# Altium project PCB_SBW_Assist.PrjPcb
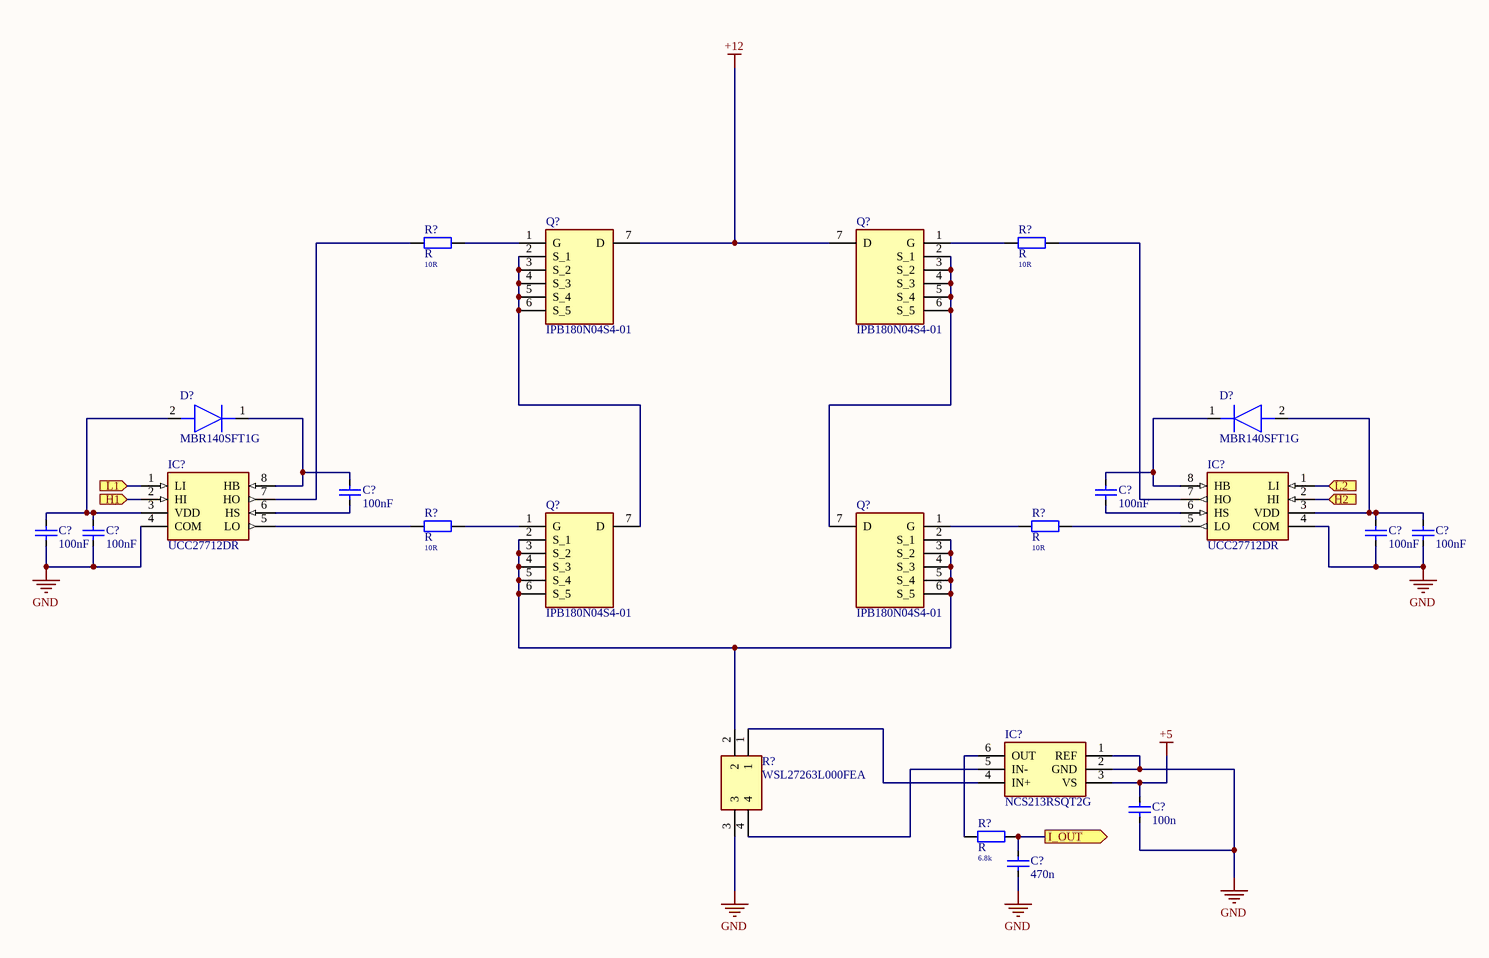
[diagram p0: PCB_SBW_Assist.SchDoc]
3 sheets, 129 parts. Net scope: flat (ports and power ports of the same name join across sheets).
Board file: PCB_SBW_Assist.PcbDoc
Sheets:
  PCB_SBW_Assist.SchDoc
  Microcontroller.SchDoc
  analog_signal.SchDoc

## Sheet PCB_SBW_Assist.SchDoc
size A2

### Parts
(Parts that share a designator on the sheet are numbered #1, #2 ... from top to bottom, then left to right.)
C?#1  value 100nF  [CAPC3216X18N]  (hidden comment: C)
C?#2  value 100nF  [CAPC3216X18N]  (hidden comment: C)
C?#3  value 100nF  [CAPC3216X18N]  (hidden comment: C)
C?#4  value 100nF  [CAPC3216X18N]  (hidden comment: C)
C?#5  value 100nF  [CAPC3216X18N]  (hidden comment: C)
C?#6  value 100nF  [CAPC3216X18N]  (hidden comment: C)
C?#7  value 100n  [CAPC3216X18N]  (hidden comment: C)
C?#8  value 470n  [CAPC3216X18N]  (hidden comment: C)
D?#1  MBR140SFT1G  [SODFL3616X98N]
D?#2  MBR140SFT1G  [SODFL3616X98N]
IC?#1  UCC27712DR  [SOIC127P600X175-8N]
IC?#2  UCC27712DR  [SOIC127P600X175-8N]
IC?#3  NCS213RSQT2G  [SOT65P210X110-6N]
Q?#1  IPB180N04S4-01  [IPB240N04S4R9ATMA1]
Q?#2  IPB180N04S4-01  [IPB240N04S4R9ATMA1]
Q?#3  IPB180N04S4-01  [IPB240N04S4R9ATMA1]
Q?#4  IPB180N04S4-01  [IPB240N04S4R9ATMA1]
R?#1  R  value 10R  [RESC3216X07N]
R?#2  R  value 10R  [RESC3216X07N]
R?#3  R  value 10R  [RESC3216X07N]
R?#4  R  value 10R  [RESC3216X07N]
R?#5  WSL27263L000FEA  [WSL27263L000FEA]
R?#6  R  value 6.8k  [RESC1608X06N]

### Ports
H1 (in), H2 (in), I_OUT (out), L1 (in), L2 (in)

### Nets
+5: C?#7.2 IC?#3.3(VS)
+12: Q?#1.7(D) Q?#2.7(D)
GND: C?#3.1 C?#4.1 C?#5.1 C?#6.1 C?#7.1 C?#8.1 IC?#1.4(COM) IC?#2.4(COM) IC?#3.1(REF) IC?#3.2(GND) R?#5.3
NetC?#1_1: C?#1.1 IC?#1.6(HS)
NetC?#1_2: C?#1.2 D?#1.1(K) IC?#1.8(HB)
NetC?#2_1: C?#2.1 IC?#2.6(HS)
NetC?#2_2: C?#2.2 D?#2.1(K) IC?#2.8(HB)
NetC?#3_2: C?#3.2 C?#4.2 D?#1.2(A) IC?#1.3(VDD)
NetC?#5_2: C?#5.2 C?#6.2 D?#2.2(A) IC?#2.3(VDD)
NetC?#8_2: C?#8.2 R?#6.2 ; port I_OUT
NetIC?#1_1: IC?#1.1(LI) ; port L1
NetIC?#1_2: IC?#1.2(HI) ; port H1
NetIC?#1_5: IC?#1.5(LO) R?#3.1
NetIC?#1_7: IC?#1.7(HO) R?#1.1
NetIC?#2_1: IC?#2.1(LI) ; port L2
NetIC?#2_2: IC?#2.2(HI) ; port H2
NetIC?#2_5: IC?#2.5(LO) R?#4.2
NetIC?#2_7: IC?#2.7(HO) R?#2.2
NetIC?#3_4: IC?#3.4(IN+) R?#5.1
NetIC?#3_5: IC?#3.5(IN-) R?#5.4
NetIC?#3_6: IC?#3.6(OUT) R?#6.1
NetQ?#1_1: Q?#1.1(G) R?#1.2
NetQ?#1_2: Q?#1.2(S_1) Q?#1.3(S_2) Q?#1.4(S_3) Q?#1.5(S_4) Q?#1.6(S_5) Q?#3.7(D)
NetQ?#2_1: Q?#2.1(G) R?#2.1
NetQ?#2_2: Q?#2.2(S_1) Q?#2.3(S_2) Q?#2.4(S_3) Q?#2.5(S_4) Q?#2.6(S_5) Q?#4.7(D)
NetQ?#3_1: Q?#3.1(G) R?#3.2
NetQ?#3_2: Q?#3.2(S_1) Q?#3.3(S_2) Q?#3.4(S_3) Q?#3.5(S_4) Q?#3.6(S_5) Q?#4.2(S_1) Q?#4.3(S_2) Q?#4.4(S_3) Q?#4.5(S_4) Q?#4.6(S_5) R?#5.2
NetQ?#4_1: Q?#4.1(G) R?#4.1

### Notes on the sheet
- Title
- Size:
- Date:
- File:
- A2
- Number:
- Time:
- Revision:
- Sheet
- of

### Library data of the parts
C?#1-C?#6 = C: Parameter 2: 06033C104KAT4A; Link: https://www.lcsc.com/product-detail/Multilayer-Ceramic-Capacitors-MLCC-SMD-SMT_Kyocera-AVX-06033C104KAT4A_C2167104.html
C?#7 = C: MPN: 06033C104KAT4A; Link: https://www.lcsc.com/product-detail/Multilayer-Ceramic-Capacitors-MLCC-SMD-SMT_Kyocera-AVX-06033C104KAT4A_C2167104.html
C?#8 = C: MPN: Samwha Capacitor CS1608X7R474K250NRB; Link: https://www.lcsc.com/product-detail/Multilayer-Ceramic-Capacitors-MLCC-SMD-SMT_Samwha-Capacitor-CS1608X7R474K250NRB_C2909628.html
D?#1 D?#2 = MBR140SFT1G: Diode; Manufacturer_Name: onsemi; Datasheet Link: http://www.onsemi.com/pub/Collateral/MBR140SFT1-D.PDF; Height: 0.98mm; Manufacturer_Part_Number: MBR140SFT1G; Mouser Part Number: 863-MBR140SFT1G; Mouser Price/Stock: https://www.mouser.co.uk/ProductDetail/onsemi/MBR140SFT1G?qs=3JMERSakebrc0eIUjXPasA%3D%3D; Arrow Part Number: MBR140SFT1G; Arrow Price/Stock: https://www.arrow.com/en/products/mbr140sft1g/on-semiconductor?region=nac
IC?#1 IC?#2 = UCC27712DR: Integrated Circuit; Manufacturer_Name: Texas Instruments; Datasheet Link: http://www.ti.com/lit/gpn/ucc27712; Height: 1.75mm; Manufacturer_Part_Number: UCC27712DR; Mouser Part Number: 595-UCC27712DR; Mouser Price/Stock: https://www.mouser.co.uk/ProductDetail/Texas-Instruments/UCC27712DR?qs=HXFqYaX1Q2zHY4iSzkrxAA%3D%3D; Arrow Part Number: UCC27712DR; Arrow Price/Stock: https://www.arrow.com/en/products/ucc27712dr/texas-instruments?region=nac
IC?#3 = NCS213RSQT2G: Integrated Circuit; Manufacturer_Name: onsemi; Datasheet Link: http://www.onsemi.com/pub/Collateral/NCS210R-D.PDF; Height: 1.1mm; Manufacturer_Part_Number: NCS213RSQT2G; Mouser Part Number: 863-NCS213RSQT2G; Mouser Price/Stock: https://www.mouser.co.uk/ProductDetail/onsemi/NCS213RSQT2G?qs=y6ZabgHbY%252ByBI46PuwlxCQ%3D%3D; Arrow Part Number: NCS213RSQT2G; Arrow Price/Stock: https://www.arrow.com/en/products/ncs213rsqt2g/on-semiconductor?region=nac
Q?#1-Q?#4 = IRFS3107-7PPBF: MOSFET (N-Channel); Manufacturer_Name: Infineon; Datasheet Link: https://www.lcsc.com/datasheet/lcsc_datasheet_2409301305_Infineon-Technologies-IPB180N04S4-01_C536569.pdf; Height: 4mm; Manufacturer_Part_Number: IPB180N04S4-01; Mouser Part Number: 942-IRFS3107-7PPBF; Mouser Price/Stock: https://www.lcsc.com/product-detail/MOSFETs_Infineon-Technologies-IPB180N04S4-01_C536569.html; Arrow Part Number: IPB180N04S4-01; Arrow Price/Stock: https://www.arrow.com/en/products/irfs3107-7ppbf/infineon-technologies-ag
R?#1-R?#4 = R: MPN: 1206W4F100JT5E; Link: https://www.lcsc.com/product-detail/Chip-Resistor-Surface-Mount_UNI-ROYAL-Uniroyal-Elec-1206W4F100JT5E_C17903.html
R?#5 = WSL27263L000FEA: Resistor; Manufacturer_Name: Vishay; Datasheet Link: https://www.vishay.com/docs/30131/wsl2726.pdf; Height: 2.99mm; Manufacturer_Part_Number: WSL27263L000FEA; Mouser Part Number: 71-WSL27263L000FEA; Mouser Price/Stock: https://www.mouser.co.uk/ProductDetail/Vishay-Dale/WSL27263L000FEA?qs=eFWhpKjIuGhZ1Mn4MB4N%252Bg%3D%3D; Arrow Part Number: WSL27263L000FEA; Arrow Price/Stock: https://www.arrow.com/en/products/wsl27263l000fea/vishay
R?#6 = R: MPN: YAGEO RC0603FR-076K8L; Link: https://www.lcsc.com/product-detail/Chip-Resistor-Surface-Mount_YAGEO-RC0603FR-076K8L_C114632.html

## Sheet Microcontroller.SchDoc
size A2; Organization: Altium Limited; Address1: L3, 12a Rodborough Rd; Address2: Frenchs Forest; Address3: NSW; Address4: Australia 2086
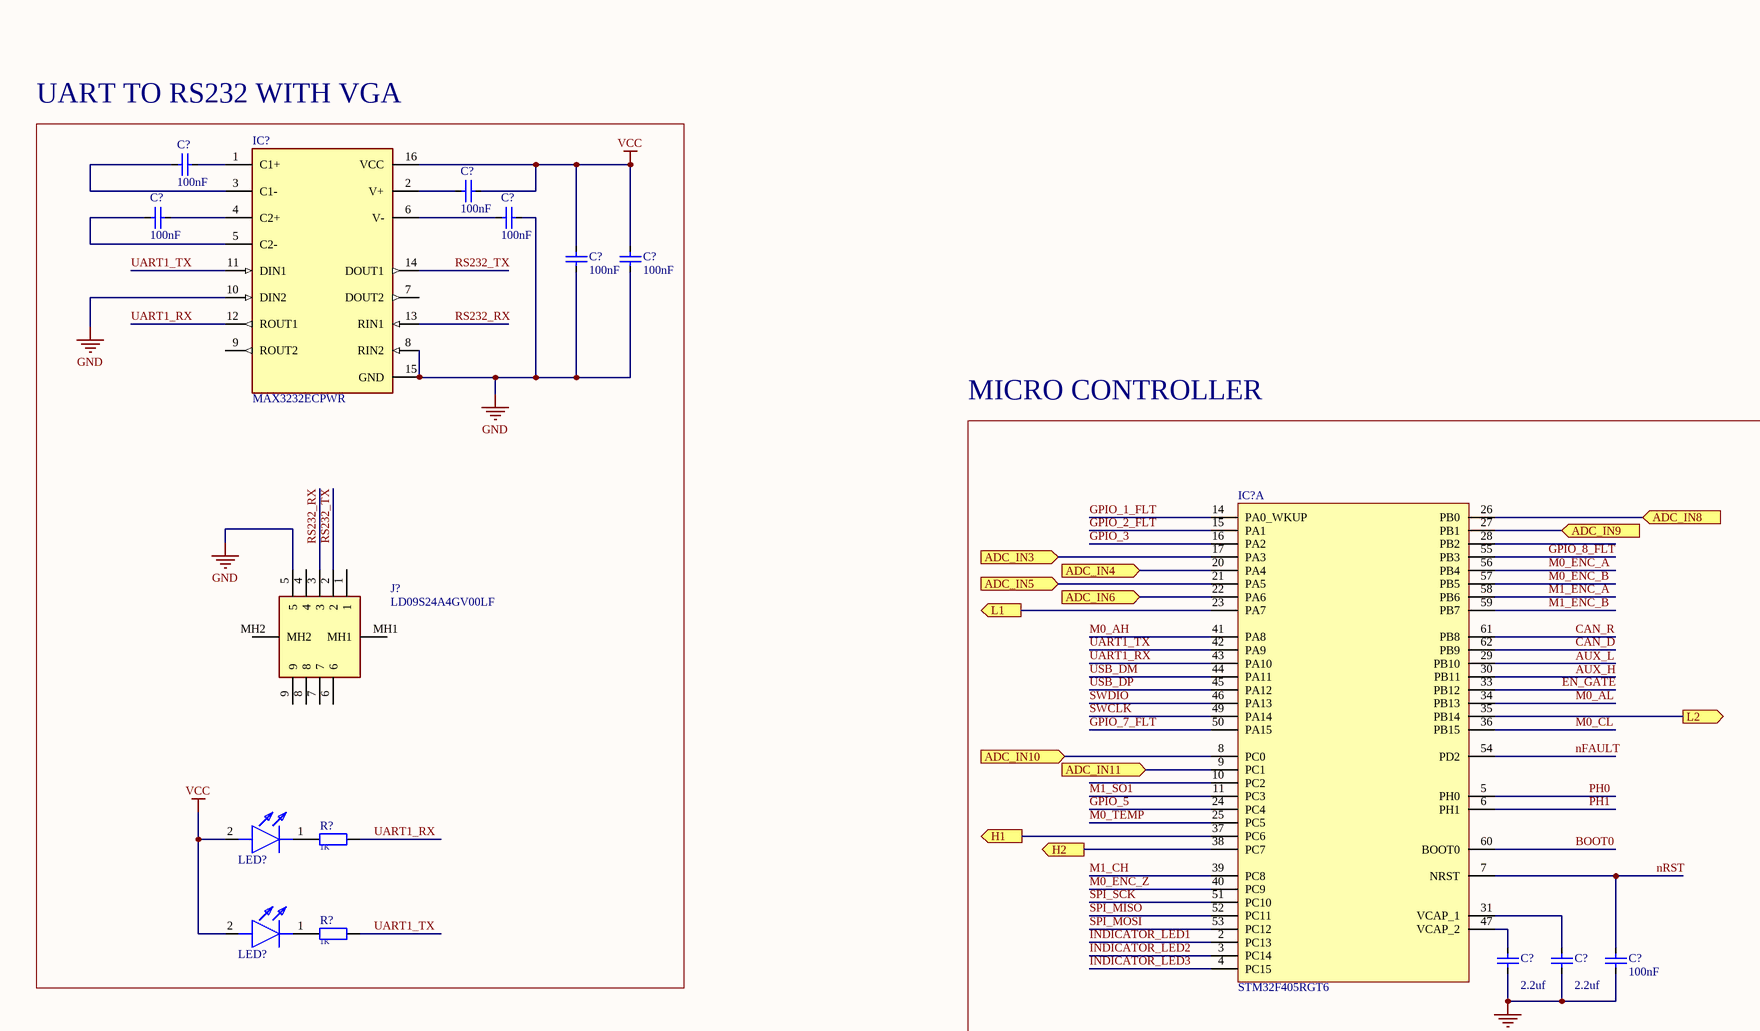
[diagram p1: Microcontroller.SchDoc, top left]
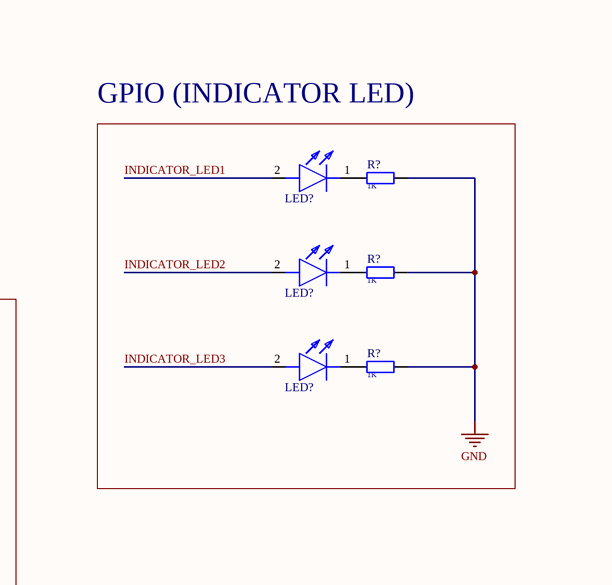
[diagram p2: Microcontroller.SchDoc, top right]
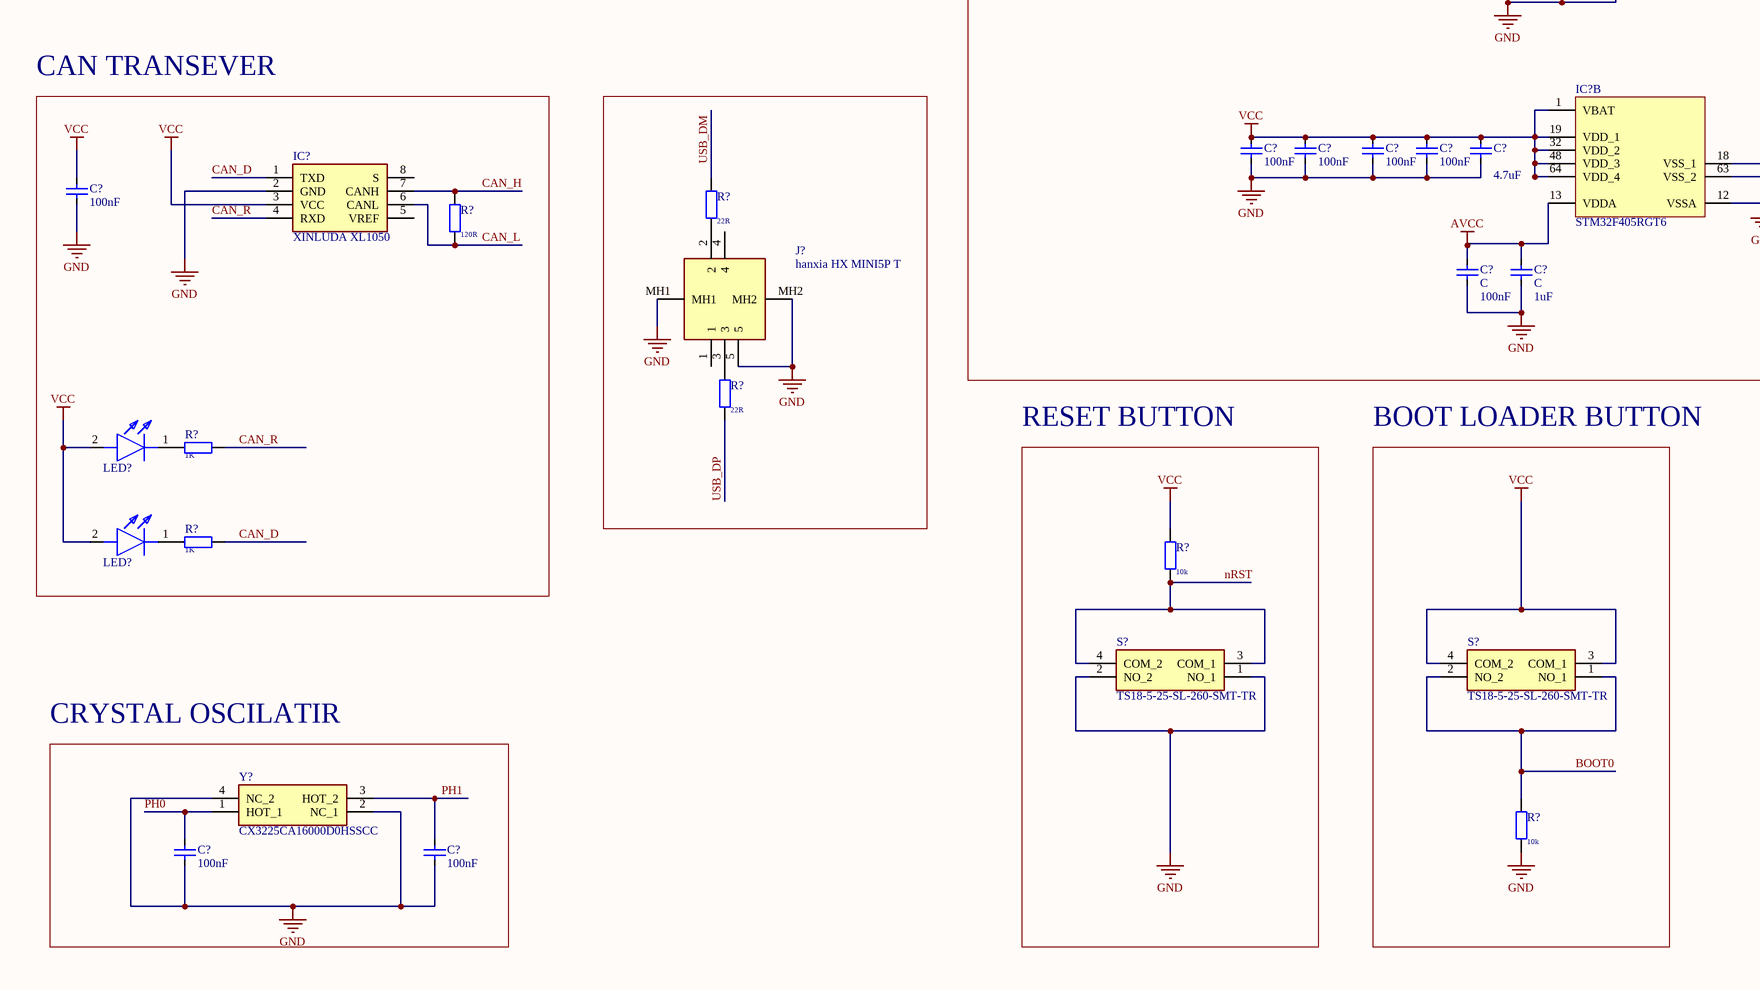
[diagram p3: Microcontroller.SchDoc, bottom left]
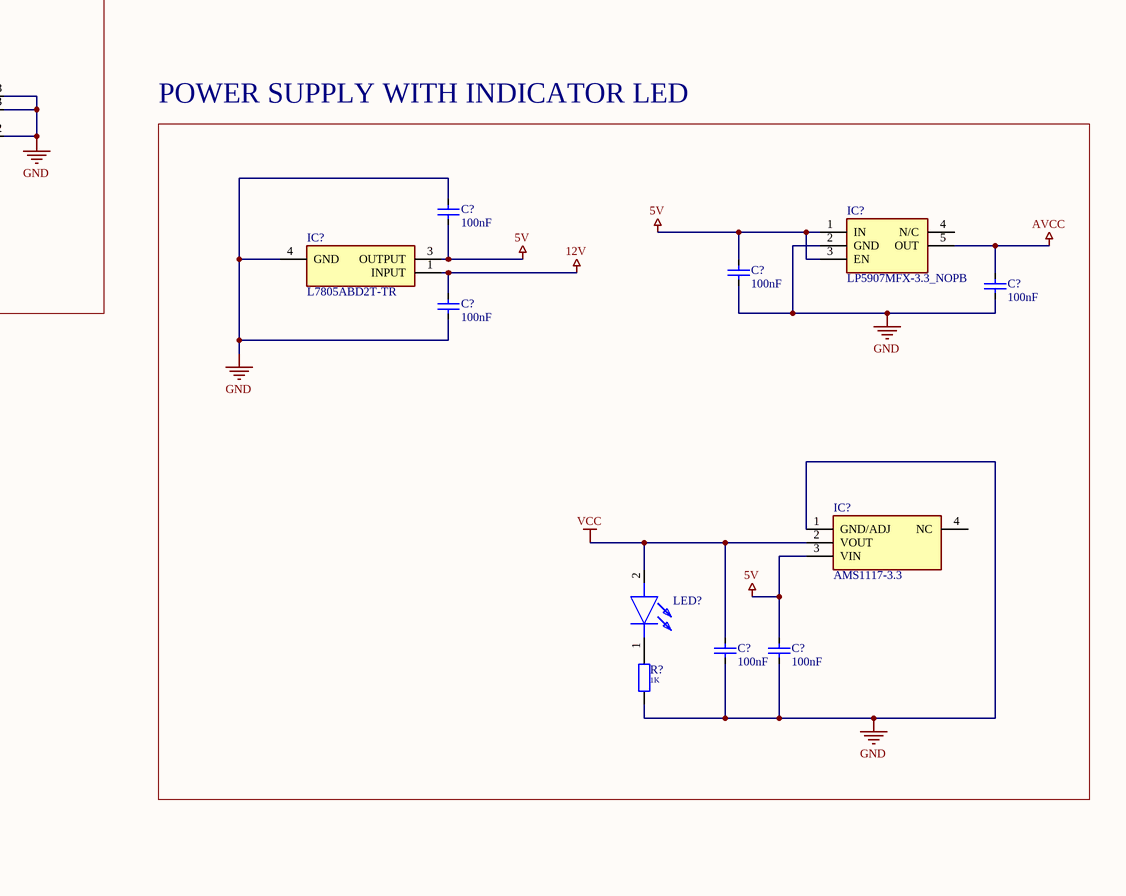
[diagram p4: Microcontroller.SchDoc, bottom right]

### Parts
(Parts that share a designator on the sheet are numbered #1, #2 ... from top to bottom, then left to right.)
C?#9  value 100nF  [CAPC3216X18N]  (hidden comment: C)
C?#10  value 100nF  [CAPC3216X18N]  (hidden comment: C)
C?#11  value 100nF  [CAPC3216X18N]  (hidden comment: C)
C?#12  value 100nF  [CAPC3216X18N]  (hidden comment: C)
C?#13  value 100nF  [CAPC3216X18N]  (hidden comment: C)
C?#14  value 100nF  [CAPC3216X18N]  (hidden comment: C)
C?#15  value 2.2uf  [CAPC1608X09N]  (hidden comment: C)
C?#16  value 2.2uf  [CAPC1608X09N]  (hidden comment: C)
C?#17  value 100nF  [CAPC3216X18N]  (hidden comment: C)
C?#18  value 100nF  [CAPC3216X18N]  (hidden comment: C)
C?#19  value 100nF  [CAPC3216X18N]  (hidden comment: C)
C?#20  value 100nF  [CAPC3216X18N]  (hidden comment: C)
C?#21  value 100nF  [CAPC3216X18N]  (hidden comment: C)
C?#22  value 4.7uF  [CAPC1608X09N]  (hidden comment: C)
C?#23  value 100nF  [CAPC3216X18N]  (hidden comment: C)
C?#24  C  value 100nF  [CAPC1608X09N]
C?#25  C  value 1uF  [CAPC1608X09N]
C?#26  value 100nF  [CAPC3216X18N]  (hidden comment: C)
C?#27  value 100nF  [CAPC3216X18N]  (hidden comment: C)
C?#28  value 100nF  [CAPC3216X18N]  (hidden comment: C)
C?#29  value 100nF  [CAPC3216X18N]  (hidden comment: C)
C?#30  value 100nF  [CAPC3216X18N]  (hidden comment: C)
C?#31  value 100nF  [CAPC3216X18N]  (hidden comment: C)
C?#32  value 100nF  [CAPC3216X18N]  (hidden comment: C)
C?#33  value 100nF  [CAPC3216X18N]  (hidden comment: C)
IC?#4  MAX3232ECPWR  [SOP65P640X120-16N]
IC?#5  STM32F405RGT6  [QFP50P1200X1200X160-64N]  (part A of 2)
IC?#6  STM32F405RGT6  [QFP50P1200X1200X160-64N]  (part B of 2)
IC?#7  XINLUDA XL1050  [SOIC127P600X175-8N]
IC?#8  LP5907MFX-3.3_NOPB  [SOT95P280X145-5N]
IC?#9  L7805ABD2T-TR  [D2PAK-STB35NF10T4]
IC?#10  AMS1117-3.3  [SOT229P700X180-4N]
J?#1  LD09S24A4GV00LF  [LD09S24A4GV00LF]
J?#2  hanxia HX MINI5P T  [10119313301TLF]
LED?#1  LTST-C190KGKT  [LEDC1608X80N]  (value not drawn)
LED?#2  LTST-C190KGKT  [LEDC1608X80N]  (value not drawn)
LED?#3  LTST-C190KGKT  [LEDC1608X80N]  (value not drawn)
LED?#4  LTST-C190KGKT  [LEDC1608X80N]  (value not drawn)
LED?#5  LTST-C190KGKT  [LEDC1608X80N]  (value not drawn)
LED?#6  LTST-C190KGKT  [LEDC1608X80N]  (value not drawn)
LED?#7  LTST-C190KGKT  [LEDC1608X80N]  (value not drawn)
LED?#8  LTST-C190KGKT  [LEDC1608X80N]  (value not drawn)
R?#7  value 1K  [RESC1608X06N]  (hidden comment: R)
R?#8  value 1K  [RESC1608X06N]  (hidden comment: R)
R?#9  value 1K  [RESC1608X06N]  (hidden comment: R)
R?#10  value 1K  [RESC1608X06N]  (hidden comment: R)
R?#11  value 1K  [RESC1608X06N]  (hidden comment: R)
R?#12  value 22R  [RESC1608X06N]  (hidden comment: R)
R?#13  value 120R  [RESC1005X04N]  (hidden comment: R)
R?#14  value 22R  [RESC1608X06N]  (hidden comment: R)
R?#15  value 1K  [RESC1608X06N]  (hidden comment: R)
R?#16  value 1K  [RESC1608X06N]  (hidden comment: R)
R?#17  value 10k  [RESC1608X06N]  (hidden comment: R)
R?#18  value 1K  [RESC1608X06N]  (hidden comment: R)
R?#19  value 10k  [RESC1608X06N]  (hidden comment: R)
S?#1  TS18-5-25-SL-260-SMT-TR  [TS18525SL260SMTTR]
S?#2  TS18-5-25-SL-260-SMT-TR  [TS18525SL260SMTTR]
Y?  CX3225CA16000D0HSSCC  [CX3225CA16000D0HSSCC]

### Blocks framed on the sheet
UART TO RS232 WITH VGA: C?#9-C?#14 IC?#4 J?#1 LED?#4 LED?#5 R?#10 R?#11
GPIO (INDICATOR LED): LED?#1-LED?#3 R?#7-R?#9
MICRO CONTROLLER: C?#15-C?#22 C?#24 C?#25 IC?#5 IC?#6
CAN TRANSEVER: C?#23 IC?#7 LED?#6 LED?#7 R?#13 R?#15 R?#16
POWER SUPPLY WITH INDICATOR LED: C?#26-C?#31 IC?#8-IC?#10 LED?#8 R?#18
RESET BUTTON: R?#17 S?#1
BOOT LOADER BUTTON: R?#19 S?#2
CRYSTAL OSCILATIR: C?#32 C?#33 Y?

### Ports
ADC_IN3 (in), ADC_IN4 (in), ADC_IN5 (in), ADC_IN6 (in), ADC_IN8 (in), ADC_IN9 (in), ADC_IN10 (in), ADC_IN11 (in), H1 (out), H2 (out), L1 (out), L2 (out)

### Nets
5V: C?#26.1 C?#27.2 C?#31.2 IC?#8.1(IN) IC?#8.3(EN) IC?#9.3(OUTPUT) IC?#10.3(VIN)
12V: C?#29.2 IC?#9.1(INPUT)
AVCC: C?#24.2 C?#25.2 C?#28.2 IC?#6.13(VDDA) IC?#8.5(OUT)
GND: C?#12.1 C?#13.1 C?#14.1 C?#15.1 C?#16.1 C?#17.1 C?#18.1 C?#19.1 C?#20.1 C?#21.1 C?#22.1 C?#23.1 C?#24.1 C?#25.1 C?#26.2 C?#27.1 C?#28.1 C?#29.1 C?#30.1 C?#31.1 C?#32.1 C?#33.1 IC?#4.8(RIN2) IC?#4.10(DIN2) IC?#4.15(GND) IC?#6.12(VSSA) IC?#6.18(VSS_1) IC?#6.63(VSS_2) IC?#7.2(GND) IC?#8.2(GND) IC?#9.4(GND) IC?#10.1(GND/ADJ) J?#1.5 J?#2.5 J?#2.MH1 J?#2.MH2 R?#7.2 R?#8.2 R?#9.2 R?#18.2 R?#19.1 S?#1.1(NO_1) S?#1.2(NO_2) Y?.2(NC_1) Y?.4(NC_2)
VCC: C?#10.1 C?#13.2 C?#14.2 C?#18.2 C?#19.2 C?#20.2 C?#21.2 C?#22.2 C?#23.2 C?#30.2 IC?#4.16(VCC) IC?#6.1(VBAT) IC?#6.19(VDD_1) IC?#6.32(VDD_2) IC?#6.48(VDD_3) IC?#6.64(VDD_4) IC?#7.3(VCC) IC?#10.2(VOUT) LED?#4.2(A) LED?#5.2(A) LED?#6.2(A) LED?#7.2(A) LED?#8.2(A) R?#17.2 S?#2.3(COM_1) S?#2.4(COM_2)
AUX_L: IC?#5.29(PB10)
BOOT0: IC?#5.60(BOOT0) R?#19.2 S?#2.1(NO_1) S?#2.2(NO_2)
CAN_D: IC?#5.62(PB9) IC?#7.1(TXD) R?#16.1
CAN_H: IC?#7.7(CANH) R?#13.2
CAN_L: IC?#7.6(CANL) R?#13.1
CAN_R: IC?#5.61(PB8) IC?#7.4(RXD) R?#15.1
EN_GATE: IC?#5.33(PB12)
GPIO_1_FLT: IC?#5.14(PA0_WKUP)
GPIO_2_FLT: IC?#5.15(PA1)
GPIO_3: IC?#5.16(PA2)
GPIO_5: IC?#5.24(PC4)
GPIO_7_FLT: IC?#5.50(PA15)
GPIO_8_FLT: IC?#5.55(PB3)
INDICATOR_LED1: IC?#5.2(PC13) LED?#1.2(A)
INDICATOR_LED2: IC?#5.3(PC14) LED?#2.2(A)
INDICATOR_LED3: IC?#5.4(PC15) LED?#3.2(A)
M0_AH: IC?#5.41(PA8)
M0_AL: IC?#5.34(PB13)
M0_CL: IC?#5.36(PB15)
M0_ENC_A: IC?#5.56(PB4)
M0_ENC_B: IC?#5.57(PB5)
M0_ENC_Z: IC?#5.40(PC9)
M0_TEMP: IC?#5.25(PC5)
M1_CH: IC?#5.39(PC8)
M1_ENC_A: IC?#5.58(PB6)
M1_ENC_B: IC?#5.59(PB7)
M1_SO1: IC?#5.11(PC3)
nFAULT: IC?#5.54(PD2)
nRST: C?#17.2 IC?#5.7(NRST) R?#17.1 S?#1.3(COM_1) S?#1.4(COM_2)
PH0: C?#32.2 IC?#5.5(PH0) Y?.1(HOT_1)
PH1: C?#33.2 IC?#5.6(PH1) Y?.3(HOT_2)
RS232_RX: IC?#4.13(RIN1) J?#1.3
RS232_TX: IC?#4.14(DOUT1) J?#1.2
SPI_MISO: IC?#5.52(PC11)
SPI_MOSI: IC?#5.53(PC12)
SPI_SCK: IC?#5.51(PC10)
SWCLK: IC?#5.49(PA14)
SWDIO: IC?#5.46(PA13)
UART1_RX: IC?#4.12(ROUT1) IC?#5.43(PA10) R?#10.1
UART1_TX: IC?#4.11(DIN1) IC?#5.42(PA9) R?#11.1
USB_DM: IC?#5.44(PA11) R?#12.2
USB_DP: IC?#5.45(PA12) R?#14.1
NetC?#9_1: C?#9.1 IC?#4.3(C1-)
NetC?#9_2: C?#9.2 IC?#4.1(C1+)
NetC?#10_2: C?#10.2 IC?#4.2(V+)
NetC?#11_1: C?#11.1 IC?#4.4(C2+)
NetC?#11_2: C?#11.2 IC?#4.5(C2-)
NetC?#12_2: C?#12.2 IC?#4.6(V-)
NetC?#15_2: C?#15.2 IC?#5.47(VCAP_2)
NetC?#16_2: C?#16.2 IC?#5.31(VCAP_1)
NetIC?#1_1: IC?#5.23(PA7) ; port L1
NetIC?#1_2: IC?#5.37(PC6) ; port H1
NetIC?#2_1: IC?#5.35(PB14) ; port L2
NetIC?#2_2: IC?#5.38(PC7) ; port H2
NetIC?#5_8: IC?#5.8(PC0) ; port ADC_IN10
NetIC?#5_9: IC?#5.9(PC1) ; port ADC_IN11
NetIC?#5_17: IC?#5.17(PA3) ; port ADC_IN3
NetIC?#5_20: IC?#5.20(PA4) ; port ADC_IN4
NetIC?#5_21: IC?#5.21(PA5) ; port ADC_IN5
NetIC?#5_22: IC?#5.22(PA6) ; port ADC_IN6
NetIC?#5_26: IC?#5.26(PB0) ; port ADC_IN8
NetIC?#5_27: IC?#5.27(PB1) ; port ADC_IN9
NetJ?#2_2: J?#2.2 R?#12.1
NetJ?#2_3: J?#2.3 R?#14.2
NetLED?#1_1: LED?#1.1(K) R?#7.1
NetLED?#2_1: LED?#2.1(K) R?#8.1
NetLED?#3_1: LED?#3.1(K) R?#9.1
NetLED?#4_1: LED?#4.1(K) R?#10.2
NetLED?#5_1: LED?#5.1(K) R?#11.2
NetLED?#6_1: LED?#6.1(K) R?#15.2
NetLED?#7_1: LED?#7.1(K) R?#16.2
NetLED?#8_1: LED?#8.1(K) R?#18.1

Not connected (* = marked no-connect by the designer): IC?#4 7(DOUT2) 9(ROUT2); IC?#5 10(PC2) 28(PB2) 30(PB11); IC?#7 5(VREF) 8(S); IC?#8 4(N/C); IC?#10 4(NC); J?#1 1 4 6 7 8 9 MH1 MH2; J?#2 1 4

### Notes on the sheet
- Labels drawn without touching a wire or pin: AUX_H
- Title
- Size:
- Date:
- File:
- A2
- Number:
- Time:
- Revision:
- Sheet
- of

### Library data of the parts
C?#9-C?#14 C?#17-C?#21 C?#23 C?#26-C?#33 = C: Parameter 2: 06033C104KAT4A; Link: https://www.lcsc.com/product-detail/Multilayer-Ceramic-Capacitors-MLCC-SMD-SMT_Kyocera-AVX-06033C104KAT4A_C2167104.html
C?#15 C?#16 = C: MPN: 0603B225K250NT; Link: https://www.lcsc.com/product-detail/Multilayer-Ceramic-Capacitors-MLCC-SMD-SMT_FH-Guangdong-Fenghua-Advanced-Tech-0603B225K250NT_C99228.html
C?#22 = C: MPN: CS3216X7R475K160NRI; Link: https://www.lcsc.com/product-detail/Multilayer-Ceramic-Capacitors-MLCC-SMD-SMT_Samwha-Capacitor-CS3216X7R475K160NRI_C5189824.html
C?#25 = C: MPN: CL10B105KP8NNNC; Link: https://www.lcsc.com/product-detail/Multilayer-Ceramic-Capacitors-MLCC-SMD-SMT_Samsung-Electro-Mechanics-CL10B105KP8NNNC_C95843.html
IC?#4 = MAX3232ECPWR: Integrated Circuit; Manufacturer_Name: Texas Instruments; Datasheet Link: http://www.ti.com/general/docs/lit/getliterature.tsp?genericPartNumber=MAX3232E&fileType=pdf&HQS=ti-null-null-sf-df-pf-sep-wwe&DCM=yes; Height: 1.2mm; Manufacturer_Part_Number: MAX3232ECPWR; Mouser Part Number: 595-MAX3232ECPWR; Mouser Price/Stock: https://www.mouser.co.uk/ProductDetail/Texas-Instruments/MAX3232ECPWR?qs=paYhMW8qfis8NsHohmO7ng%3D%3D; Arrow Part Number: MAX3232ECPWR; Arrow Price/Stock: https://www.arrow.com/en/products/max3232ecpwr/texas-instruments?region=nac
IC?#5 IC?#6 = STM32F405RGT6: Integrated Circuit; Manufacturer_Name: STMicroelectronics; Datasheet Link: http://www.st.com/web/en/resource/technical/document/datasheet/DM00037051.pdf; Height: 1.6mm; Manufacturer_Part_Number: STM32F405RGT6; Mouser Part Number: 511-STM32F405RGT6; Mouser Price/Stock: https://www.mouser.co.uk/ProductDetail/STMicroelectronics/STM32F405RGT6?qs=Z8%252BeY1k3TIKgj7QWsYGpQw%3D%3D; Arrow Part Number: STM32F405RGT6; Arrow Price/Stock: https://www.arrow.com/en/products/stm32f405rgt6/stmicroelectronics?utm_currency=USD&region=nac
IC?#7 = TJA1050T_CM: Integrated Circuit; Manufacturer_Name: NXP; Datasheet Link: https://www.lcsc.com/product-detail/CAN-Transceivers_XINLUDA-XL1050_C609746.html; Height: 1.75mm; Manufacturer_Part_Number: XINLUDA XL1050; Mouser Part Number: N/A; Mouser Price/Stock: https://www.mouser.co.uk/ProductDetail/NXP-Semiconductors/TJA1050T-CM?qs=fAHHVMwC%252BbibiWs27gP5ng%3D%3D
IC?#8 = LP5907MFX-3.3_NOPB: Integrated Circuit; Manufacturer_Name: Texas Instruments; Manufacturer_Part_Number: LP5907MFX-3.3/NOPB; Datasheet Link: https://datasheet.datasheetarchive.com/originals/distributors/Datasheets-SFU2/DSASFU100037200.pdf; Height: 1.45mm; Mouser Part Number: 595-LP5907MFX-3.3NPB; Mouser Price/Stock: https://www.mouser.co.uk/ProductDetail/Texas-Instruments/LP5907MFX-3.3-NOPB?qs=biyDIajrTn6NhrJCoL%2FdSQ%3D%3D; Arrow Part Number: LP5907MFX-3.3/NOPB; Arrow Price/Stock: https://www.arrow.com/en/products/lp5907mfx-3.3nopb/texas-instruments?utm_currency=USD&region=nac
IC?#9 = L7805ABD2T-TR: Integrated Circuit; Manufacturer_Name: STMicroelectronics; Datasheet Link: https://www.st.com/resource/en/datasheet/l78.pdf; Manufacturer_Part_Number: L7805ABD2T-TR; Mouser Part Number: 511-L7805ABD2T-TR; Mouser Price/Stock: https://www.mouser.co.uk/ProductDetail/STMicroelectronics/L7805ABD2T-TR?qs=LL%252BsqOK9SqOQ%2FfZD5ZsNqA%3D%3D; Arrow Part Number: L7805ABD2T-TR; Arrow Price/Stock: https://www.arrow.com/en/products/l7805abd2t-tr/stmicroelectronics?utm_currency=USD&region=nac
IC?#10 = AMS1117-3.3: Integrated Circuit; Manufacturer_Name: Advanced; Datasheet Link: https://datasheet.datasheetarchive.com/originals/distributors/Datasheets-28/DSA-550594.pdf; Height: 1.8mm; Manufacturer_Part_Number: AMS1117-3.3
J?#1 = LD09S24A4GV00LF: Connector; Manufacturer_Name: Amphenol Communications Solutions; Datasheet Link: https://cdn.amphenol-cs.com/media/wysiwyg/files/drawing/10130912.pdf; Height: 12.39mm; Manufacturer_Part_Number: LD09S24A4GV00LF; Arrow Part Number: LD09S24A4GV00LF; Arrow Price/Stock: https://www.arrow.com/en/products/ld09s24a4gv00lf/amphenol-fci?utm_currency=USD&region=nac
J?#2 = 10119313-301TLF: Connector; Manufacturer_Name: Amphenol; Datasheet Link: https://www.lcsc.com/product-detail/USB-Connectors_hanxia-HX-MINI5P-T_C19189146.html; Height: 9.7mm; Manufacturer_Part_Number: hanxia HX MINI5P T; Mouser Part Number: 649-10119313-301TLF; Mouser Price/Stock: https://www.mouser.co.uk/ProductDetail/Amphenol-FCI/10119313-301TLF?qs=QcFhgjUTvvrAeUuachPUXg%3D%3D
LED?#1 = LTST-C190KGKT: LED; Manufacturer_Name: Lite-On; Manufacturer_Part_Number: 19-217UYOC/S3112/TR8; Datasheet Link: https://www.lcsc.com/datasheet/lcsc_datasheet_2004131606_Everlight-Elec-19-217UYOC-S3112-TR8_C264473.pdf; Height: 0.8mm; Lcsc Part Number: C965799; Lcsc Price/Stock: https://www.lcsc.com/product-detail/LED-Indication-Discrete_Everlight-Elec-19-217UYOC-S3112-TR8_C264473.html; Arrow Part Number: LTST-C190KGKT; Arrow Price/Stock: https://www.arrow.com/en/products/ltst-c190kgkt/lite-on-technology?region=europe
LED?#2 = LTST-C190KGKT: LED; Manufacturer_Name: Lite-On; Manufacturer_Part_Number: XL-1608UGC-04; Datasheet Link: https://www.lcsc.com/datasheet/lcsc_datasheet_2402181505_XINGLIGHT-XL-1608UGC-04_C965804.pdf; Height: 0.8mm; Lcsc Part Number: C965799; Lcsc Price/Stock: https://www.lcsc.com/product-detail/LED-Indication-Discrete_XINGLIGHT-XL-1608UGC-04_C965804.html; Arrow Part Number: LTST-C190KGKT; Arrow Price/Stock: https://www.arrow.com/en/products/ltst-c190kgkt/lite-on-technology?region=europe
LED?#3 LED?#5 LED?#7 = LTST-C190KGKT: LED; Manufacturer_Name: Lite-On; Manufacturer_Part_Number: XL-1608UBC-04; Height: 0.8mm; Arrow Part Number: LTST-C190KGKT; Arrow Price/Stock: https://www.arrow.com/en/products/ltst-c190kgkt/lite-on-technology?region=europe
  LED?#3: Datasheet Link: https://www.lcsc.com/datasheet/lcsc_datasheet_2402181505_XINGLIGHT-XL-1608UBC-04_C965807.pdf; Lcsc Part Number: C965799; Lcsc Price/Stock: https://www.lcsc.com/product-detail/LED-Indication-Discrete_XINGLIGHT-XL-1608UBC-04_C965807.html
  LED?#5 LED?#7: Datasheet Link: http://uk.rs-online.com/web/p/visible-leds/6920988/; Mouser Part Number: 859-LTST-C190KGKT; Mouser Price/Stock: https://www.mouser.co.uk/ProductDetail/Lite-On/LTST-C190KGKT?qs=205qCy6M2Q%252BAdcgwUZktqw%3D%3D; Link: https://www.lcsc.com/product-detail/LED-Indication-Discrete_XINGLIGHT-XL-1608UBC-04_C965807.html
LED?#4 LED?#6 = LTST-C190KGKT: LED; Manufacturer_Name: Lite-On; Manufacturer_Part_Number: XL-1608PGC-06; Datasheet Link: http://uk.rs-online.com/web/p/visible-leds/6920988/; Height: 0.8mm; Mouser Part Number: 859-LTST-C190KGKT; Mouser Price/Stock: https://www.mouser.co.uk/ProductDetail/Lite-On/LTST-C190KGKT?qs=205qCy6M2Q%252BAdcgwUZktqw%3D%3D; Arrow Part Number: LTST-C190KGKT; Arrow Price/Stock: https://www.arrow.com/en/products/ltst-c190kgkt/lite-on-technology?region=europe; Link: https://www.lcsc.com/product-detail/LED-Indication-Discrete_XINGLIGHT-XL-1608PGC-06_C7371905.html
LED?#8 = LTST-C190KGKT: LED; Manufacturer_Name: Lite-On; Datasheet Link: http://uk.rs-online.com/web/p/visible-leds/6920988/; Height: 0.8mm; Manufacturer_Part_Number: LTST-C190KGKT; Mouser Part Number: 859-LTST-C190KGKT; Mouser Price/Stock: https://www.mouser.co.uk/ProductDetail/Lite-On/LTST-C190KGKT?qs=205qCy6M2Q%252BAdcgwUZktqw%3D%3D; Arrow Part Number: LTST-C190KGKT; Arrow Price/Stock: https://www.arrow.com/en/products/ltst-c190kgkt/lite-on-technology?region=europe
R?#7-R?#11 R?#18 = R: MPN: 0603WAF1001T5E; Link: https://www.lcsc.com/product-detail/Chip-Resistor-Surface-Mount_UNI-ROYAL-Uniroyal-Elec-0603WAF1001T5E_C21190.html
R?#12 R?#14 = R: MPN: 0603WAF220JT5E; Link: https://www.lcsc.com/product-detail/Chip-Resistor-Surface-Mount_UNI-ROYAL-Uniroyal-Elec-0603WAF220JT5E_C23345.html
R?#13 = R: MPN: 0603WAF1200T5E; Link: https://www.lcsc.com/product-detail/Chip-Resistor-Surface-Mount_UNI-ROYAL-Uniroyal-Elec-0603WAF1200T5E_C22787.html
R?#15 R?#16 = R: MPN: RT0603FRD071KL; Link: https://www.lcsc.com/product-detail/Chip-Resistor-Surface-Mount_YAGEO-RT0603FRD071KL_C136938.html
R?#17 R?#19 = R: MPN: RC0603FR-0710KL; Link: https://www.lcsc.com/product-detail/Chip-Resistor-Surface-Mount_YAGEO-RC0603FR-0710KL_C98220.html
S?#1 S?#2 = TS18-5-25-SL-260-SMT-TR: Switch; Manufacturer_Name: Same Sky; Datasheet Link: https://www.sameskydevices.com/product/resource/supplyframepdf/ts18.pdf; Height: 2.7mm; Manufacturer_Part_Number: TS18-5-25-SL-260-SMT-TR; Mouser Part Number: 179-TS18525SL260SMTT; Mouser Price/Stock: https://www.mouser.co.uk/ProductDetail/Same-Sky/TS18-5-25-SL-260-SMT-TR?qs=tlsG%2FOw5FFh0yS4gYnfcwg%3D%3D
Y? = CX3225CA16000D0HSSCC: Crystal or Oscillator; Manufacturer_Name: Kyocera AVX; Datasheet Link: https://media.digikey.com/pdf/Data%20Sheets/AVX%20PDFs/CX3225CA_%20Series_Spec.pdf; Height: 0.9mm; Manufacturer_Part_Number: CX3225CA16000D0HSSCC; Mouser Part Number: N/A; Mouser Price/Stock: https://www.mouser.co.uk/ProductDetail/Kyocera-Electronic-Components/CX3225CA16000D0HSSCC?qs=A6eO%252BMLsxmRcoOtVnFyCOA%3D%3D; Arrow Part Number: CX3225CA16000D0HSSCC; Arrow Price/Stock: https://www.arrow.com/en/products/cx3225ca16000d0hsscc/kyocera
C?#24 = C: Parameter 2: *; Link: *

## Sheet analog_signal.SchDoc
size A2; Organization: Altium Limited; Address1: L3, 12a Rodborough Rd; Address2: Frenchs Forest; Address3: NSW; Address4: Australia 2086
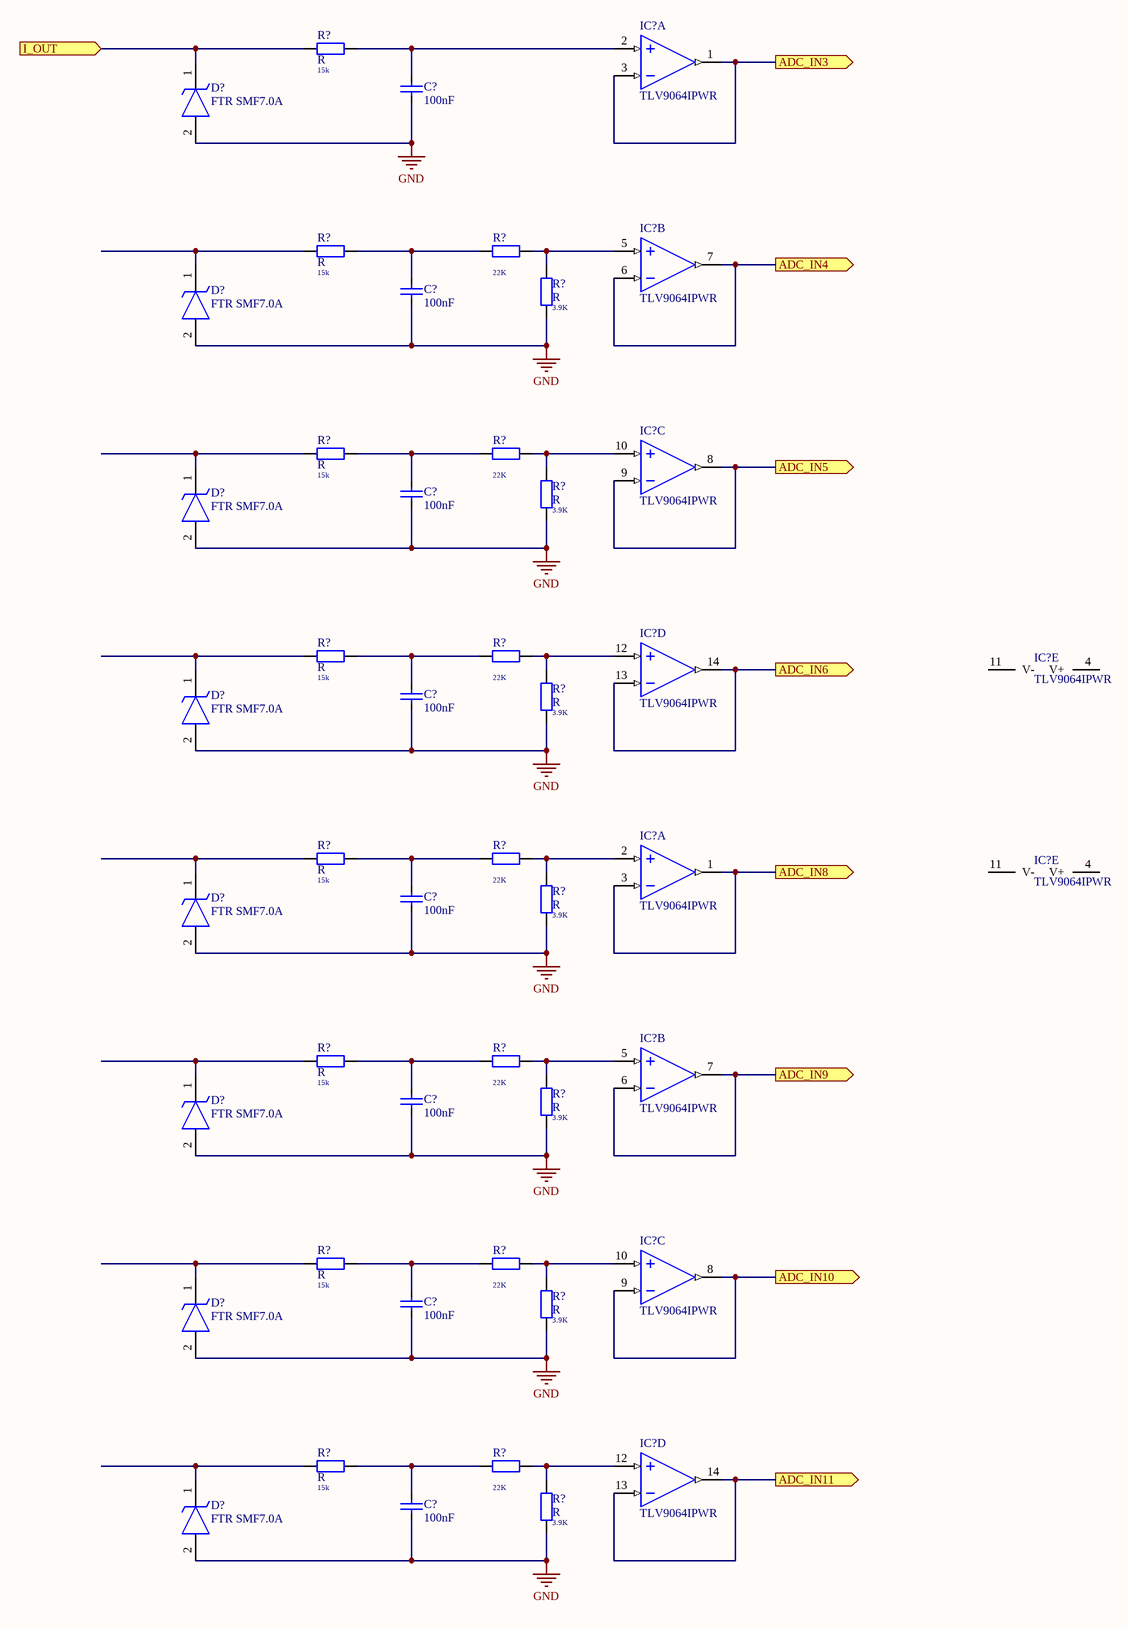
[diagram p5: analog_signal.SchDoc]

### Parts
(Parts that share a designator on the sheet are numbered #1, #2 ... from top to bottom, then left to right.)
C?#34  value 100nF  [CAPC3216X18N]  (hidden comment: C)
C?#35  value 100nF  [CAPC3216X18N]  (hidden comment: C)
C?#36  value 100nF  [CAPC3216X18N]  (hidden comment: C)
C?#37  value 100nF  [CAPC3216X18N]  (hidden comment: C)
C?#38  value 100nF  [CAPC3216X18N]  (hidden comment: C)
C?#39  value 100nF  [CAPC3216X18N]  (hidden comment: C)
C?#40  value 100nF  [CAPC3216X18N]  (hidden comment: C)
C?#41  value 100nF  [CAPC3216X18N]  (hidden comment: C)
D?#3  FTR SMF7.0A  [SMF70ATP]
D?#4  FTR SMF7.0A  [SMF70ATP]
D?#5  FTR SMF7.0A  [SMF70ATP]
D?#6  FTR SMF7.0A  [SMF70ATP]
D?#7  FTR SMF7.0A  [SMF70ATP]
D?#8  FTR SMF7.0A  [SMF70ATP]
D?#9  FTR SMF7.0A  [SMF70ATP]
D?#10  FTR SMF7.0A  [SMF70ATP]
IC?#11  TLV9064IPWR  [SOP65P640X120-14N]  (part A of 5)
IC?#12  TLV9064IPWR  [SOP65P640X120-14N]  (part B of 5)
IC?#13  TLV9064IPWR  [SOP65P640X120-14N]  (part C of 5)
IC?#14  TLV9064IPWR  [SOP65P640X120-14N]  (part D of 5)
IC?#15  TLV9064IPWR  [SOP65P640X120-14N]  (part E of 5)
IC?#16  TLV9064IPWR  [SOP65P640X120-14N]  (part A of 5)
IC?#17  TLV9064IPWR  [SOP65P640X120-14N]  (part E of 5)
IC?#18  TLV9064IPWR  [SOP65P640X120-14N]  (part B of 5)
IC?#19  TLV9064IPWR  [SOP65P640X120-14N]  (part C of 5)
IC?#20  TLV9064IPWR  [SOP65P640X120-14N]  (part D of 5)
R?#20  R  value 15k  [RESC1005X04N]
R?#21  R  value 15k  [RESC1005X04N]
R?#22  value 22K  [RESC1608X06N]  (hidden comment: R)
R?#23  R  value 3.9K  [RESC1005X04N]
R?#24  R  value 15k  [RESC1005X04N]
R?#25  value 22K  [RESC1608X06N]  (hidden comment: R)
R?#26  R  value 3.9K  [RESC1005X04N]
R?#27  R  value 15k  [RESC1005X04N]
R?#28  value 22K  [RESC1608X06N]  (hidden comment: R)
R?#29  R  value 3.9K  [RESC1005X04N]
R?#30  R  value 15k  [RESC1005X04N]
R?#31  value 22K  [RESC1608X06N]  (hidden comment: R)
R?#32  R  value 3.9K  [RESC1005X04N]
R?#33  R  value 15k  [RESC1005X04N]
R?#34  value 22K  [RESC1608X06N]  (hidden comment: R)
R?#35  R  value 3.9K  [RESC1005X04N]
R?#36  R  value 15k  [RESC1005X04N]
R?#37  value 22K  [RESC1608X06N]  (hidden comment: R)
R?#38  R  value 3.9K  [RESC1005X04N]
R?#39  R  value 15k  [RESC1005X04N]
R?#40  value 22K  [RESC1608X06N]  (hidden comment: R)
R?#41  R  value 3.9K  [RESC1005X04N]

### Ports
ADC_IN3 (out), ADC_IN4 (out), ADC_IN5 (out), ADC_IN6 (out), ADC_IN8 (out), ADC_IN9 (out), ADC_IN10 (out), ADC_IN11 (out), I_OUT (in)

### Nets
GND: C?#34.1 C?#35.1 C?#36.1 C?#37.1 C?#38.1 C?#39.1 C?#40.1 C?#41.1 D?#3.2(A) D?#4.2(A) D?#5.2(A) D?#6.2(A) D?#7.2(A) D?#8.2(A) D?#9.2(A) D?#10.2(A) R?#23.1 R?#26.1 R?#29.1 R?#32.1 R?#35.1 R?#38.1 R?#41.1
NetC?#8_2: D?#3.1(K) R?#20.1 ; port I_OUT
NetC?#34_2: C?#34.2 IC?#11.2(IN1-) R?#20.2
NetC?#35_2: C?#35.2 R?#21.2 R?#22.1
NetC?#36_2: C?#36.2 R?#24.2 R?#25.1
NetC?#37_2: C?#37.2 R?#27.2 R?#28.1
NetC?#38_2: C?#38.2 R?#30.2 R?#31.1
NetC?#39_2: C?#39.2 R?#33.2 R?#34.1
NetC?#40_2: C?#40.2 R?#36.2 R?#37.1
NetC?#41_2: C?#41.2 R?#39.2 R?#40.1
NetD?#4_1: D?#4.1(K) R?#21.1
NetD?#5_1: D?#5.1(K) R?#24.1
NetD?#6_1: D?#6.1(K) R?#27.1
NetD?#7_1: D?#7.1(K) R?#30.1
NetD?#8_1: D?#8.1(K) R?#33.1
NetD?#9_1: D?#9.1(K) R?#36.1
NetD?#10_1: D?#10.1(K) R?#39.1
NetIC?#5_8: IC?#19.8(OUT3) IC?#19.9(IN3-) ; port ADC_IN10
NetIC?#5_9: IC?#20.13(IN4-) IC?#20.14(OUT4) ; port ADC_IN11
NetIC?#5_17: IC?#11.1(OUT1) IC?#11.3(IN1+) ; port ADC_IN3
NetIC?#5_20: IC?#12.6(IN2-) IC?#12.7(OUT2) ; port ADC_IN4
NetIC?#5_21: IC?#13.8(OUT3) IC?#13.9(IN3-) ; port ADC_IN5
NetIC?#5_22: IC?#14.13(IN4-) IC?#14.14(OUT4) ; port ADC_IN6
NetIC?#5_26: IC?#16.1(OUT1) IC?#16.3(IN1+) ; port ADC_IN8
NetIC?#5_27: IC?#18.6(IN2-) IC?#18.7(OUT2) ; port ADC_IN9
NetIC?#12_5: IC?#12.5(IN2+) R?#22.2 R?#23.2
NetIC?#13_10: IC?#13.10(IN3+) R?#25.2 R?#26.2
NetIC?#14_12: IC?#14.12(IN4+) R?#28.2 R?#29.2
NetIC?#16_2: IC?#16.2(IN1-) R?#31.2 R?#32.2
NetIC?#18_5: IC?#18.5(IN2+) R?#34.2 R?#35.2
NetIC?#19_10: IC?#19.10(IN3+) R?#37.2 R?#38.2
NetIC?#20_12: IC?#20.12(IN4+) R?#40.2 R?#41.2

Not connected (* = marked no-connect by the designer): IC?#15 4(V+) 11(V-); IC?#17 4(V+) 11(V-)

### Notes on the sheet
- Title
- Size:
- Date:
- File:
- A2
- Number:
- Time:
- Revision:
- Sheet
- of

### Library data of the parts
C?#34-C?#41 = C: Parameter 2: 06033C104KAT4A; Link: https://www.lcsc.com/product-detail/Multilayer-Ceramic-Capacitors-MLCC-SMD-SMT_Kyocera-AVX-06033C104KAT4A_C2167104.html
D?#3-D?#10 = SMF7.0A-TP: TVS Diode (Uni-directional); Manufacturer_Name: MCC; Datasheet Link: https://www.lcsc.com/datasheet/lcsc_datasheet_2304140030_FTR-SMF7-0A_C707468.pdf; Height: 1.35mm; Manufacturer_Part_Number: FTR SMF7.0A; Arrow Part Number: FTR SMF7.0A; Arrow Price/Stock: https://www.lcsc.com/product-detail/ESD-and-Surge-Protection-TVS-ESD_FTR-SMF7-0A_C707468.html
IC?#11-IC?#20 = TLV9064IPWR: Integrated Circuit; Manufacturer_Name: Texas Instruments; Datasheet Link: http://www.ti.com/lit/ds/symlink/tlv9064.pdf; Height: 1.2mm; Manufacturer_Part_Number: TLV9064IPWR; Mouser Part Number: 595-TLV9064IPWR; Mouser Price/Stock: https://www.mouser.co.uk/ProductDetail/Texas-Instruments/TLV9064IPWR?qs=W0yvOO0ixfHY9ZUvwjcceA%3D%3D; Arrow Part Number: TLV9064IPWR; Arrow Price/Stock: https://www.arrow.com/en/products/tlv9064ipwr/texas-instruments?utm_currency=USD&region=nac
R?#22 R?#25 R?#28 R?#31 R?#34 R?#37 R?#40 = R: MPN: 0603WAF2202T5E; Link: https://www.lcsc.com/product-detail/Chip-Resistor-Surface-Mount_UNI-ROYAL-Uniroyal-Elec-0603WAF2202T5E_C31850.html
R?#23 R?#26 R?#29 R?#32 R?#35 R?#38 R?#41 = R: MPN: 0603WAF3901T5E; Link: https://www.lcsc.com/product-detail/Chip-Resistor-Surface-Mount_UNI-ROYAL-Uniroyal-Elec-0603WAF3901T5E_C23018.html
R?#20 R?#21 R?#24 R?#27 R?#30 R?#33 R?#36 R?#39 = R: MPN: *; Link: *

## Nets that join several sheets
GND: PCB_SBW_Assist (11 pins), Microcontroller (45 pins), analog_signal (23 pins)
NetC?#8_2: PCB_SBW_Assist (C?#8.2 R?#6.2), analog_signal (D?#3.1 R?#20.1)
NetIC?#1_1: PCB_SBW_Assist (IC?#1.1), Microcontroller (IC?#5.23)
NetIC?#1_2: PCB_SBW_Assist (IC?#1.2), Microcontroller (IC?#5.37)
NetIC?#2_1: PCB_SBW_Assist (IC?#2.1), Microcontroller (IC?#5.35)
NetIC?#2_2: PCB_SBW_Assist (IC?#2.2), Microcontroller (IC?#5.38)
NetIC?#5_8: Microcontroller (IC?#5.8), analog_signal (IC?#19.8 IC?#19.9)
NetIC?#5_9: Microcontroller (IC?#5.9), analog_signal (IC?#20.13 IC?#20.14)
NetIC?#5_17: Microcontroller (IC?#5.17), analog_signal (IC?#11.1 IC?#11.3)
NetIC?#5_20: Microcontroller (IC?#5.20), analog_signal (IC?#12.6 IC?#12.7)
NetIC?#5_21: Microcontroller (IC?#5.21), analog_signal (IC?#13.8 IC?#13.9)
NetIC?#5_22: Microcontroller (IC?#5.22), analog_signal (IC?#14.13 IC?#14.14)
NetIC?#5_26: Microcontroller (IC?#5.26), analog_signal (IC?#16.1 IC?#16.3)
NetIC?#5_27: Microcontroller (IC?#5.27), analog_signal (IC?#18.6 IC?#18.7)